# EAGLE design RPi2LSD (EAGLE 6.5.0)
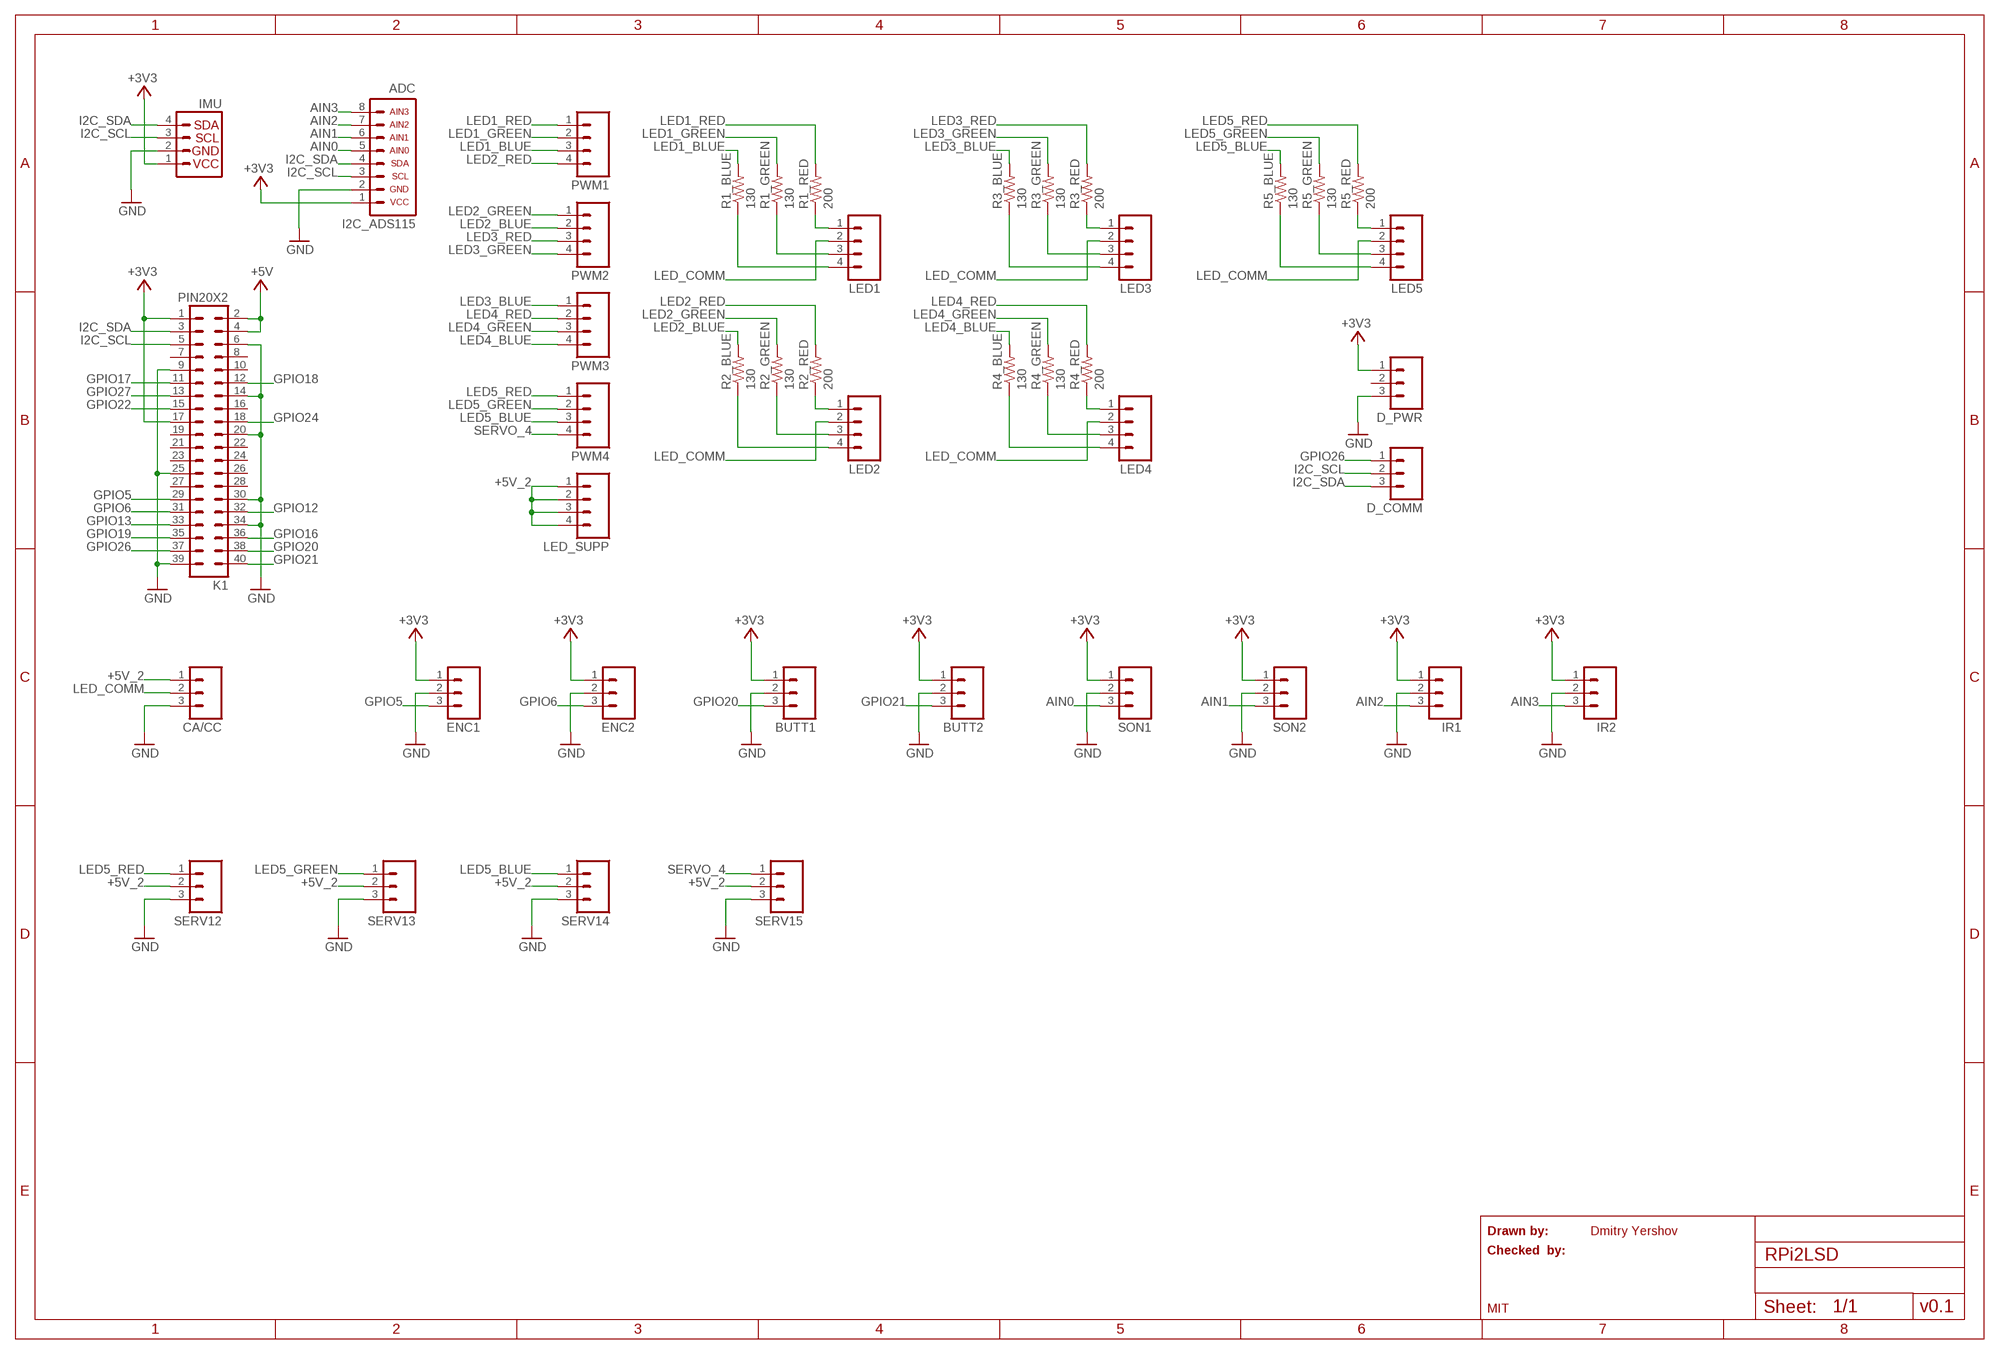
[diagram p0: schematic, sheet 1]

## Parts
ADC  I2C_ADS115  [I2C_AX4]
BUTT1  M03PTH  [1X03]
BUTT2  M03PTH  [1X03]
CA/CC  M03PTH  [1X03]
D_COMM  M03PTH  [1X03]
D_PWR  M03PTH  [1X03]
ENC1  M03PTH  [1X03]
ENC2  M03PTH  [1X03]
IMU  I2C_IMU_L3GD20H+LSM303  [1X04]
IR1  M03PTH  [1X03]
IR2  M03PTH  [1X03]
K1  PIN20X2  [PIN_20X2]
LED1  M04PTH  [1X04]
LED2  M04PTH  [1X04]
LED3  M04PTH  [1X04]
LED4  M04PTH  [1X04]
LED5  M04PTH  [1X04]
LED_SUPP  M041X04_NO_SILK  [1X04_NO_SILK]
PWM1  M041X04_NO_SILK  [1X04_NO_SILK]
PWM2  M041X04_NO_SILK  [1X04_NO_SILK]
PWM3  M041X04_NO_SILK  [1X04_NO_SILK]
PWM4  M041X04_NO_SILK  [1X04_NO_SILK]
R1_BLUE  130  R-US_0207/9  [0207/9]
R1_GREEN  130  R-US_0207/9  [0207/9]
R1_RED  200  R-US_0207/9  [0207/9]
R2_BLUE  130  R-US_0207/9  [0207/9]
R2_GREEN  130  R-US_0207/9  [0207/9]
R2_RED  200  R-US_0207/9  [0207/9]
R3_BLUE  130  R-US_0207/9  [0207/9]
R3_GREEN  130  R-US_0207/9  [0207/9]
R3_RED  200  R-US_0207/9  [0207/9]
R4_BLUE  130  R-US_0207/9  [0207/9]
R4_GREEN  130  R-US_0207/9  [0207/9]
R4_RED  200  R-US_0207/9  [0207/9]
R5_BLUE  130  R-US_0207/9  [0207/9]
R5_GREEN  130  R-US_0207/9  [0207/9]
R5_RED  200  R-US_0207/9  [0207/9]
SERV12  M03PTH  [1X03]
SERV13  M03PTH  [1X03]
SERV14  M03PTH  [1X03]
SERV15  M03PTH  [1X03]
SON1  M03PTH  [1X03]
SON2  M03PTH  [1X03]

## Nets
+3V3: ADC.1 BUTT1.1 BUTT2.1 D_PWR.1 ENC1.1 ENC2.1 IMU.1 IR1.1 IR2.1 K1.1 K1.17 SON1.1 SON2.1
+5V: K1.2 K1.4
+5V_2: CA/CC.1 LED_SUPP.1 LED_SUPP.2 LED_SUPP.3 LED_SUPP.4 SERV12.2 SERV13.2 SERV14.2 SERV15.2
AIN0: ADC.5 SON1.3
AIN1: ADC.6 SON2.3
AIN2: ADC.7 IR1.3
AIN3: ADC.8 IR2.3
GND: ADC.2 BUTT1.2 BUTT2.2 CA/CC.3 D_PWR.3 ENC1.2 ENC2.2 IMU.2 IR1.2 IR2.2 K1.6 K1.9 K1.14 K1.20 K1.25 K1.30 K1.34 K1.39 SERV12.3 SERV13.3 SERV14.3 SERV15.3 SON1.2 SON2.2
GPIO5: ENC1.3 K1.29
GPIO6: ENC2.3 K1.31
GPIO12: K1.32
GPIO13: K1.33
GPIO16: K1.36
GPIO17: K1.11
GPIO18: K1.12
GPIO19: K1.35
GPIO20: BUTT1.3 K1.38
GPIO21: BUTT2.3 K1.40
GPIO22: K1.15
GPIO24: K1.18
GPIO26: D_COMM.1 K1.37
GPIO27: K1.13
I2C_SCL: ADC.3 D_COMM.2 IMU.3 K1.5
I2C_SDA: ADC.4 D_COMM.3 IMU.4 K1.3
LED1_BLUE: PWM1.3 R1_BLUE.2
LED1_GREEN: PWM1.2 R1_GREEN.2
LED1_RED: PWM1.1 R1_RED.2
LED2_BLUE: PWM2.2 R2_BLUE.2
LED2_GREEN: PWM2.1 R2_GREEN.2
LED2_RED: PWM1.4 R2_RED.2
LED3_BLUE: PWM3.1 R3_BLUE.2
LED3_GREEN: PWM2.4 R3_GREEN.2
LED3_RED: PWM2.3 R3_RED.2
LED4_BLUE: PWM3.4 R4_BLUE.2
LED4_GREEN: PWM3.3 R4_GREEN.2
LED4_RED: PWM3.2 R4_RED.2
LED5_BLUE: PWM4.3 R5_BLUE.2 SERV14.1
LED5_GREEN: PWM4.2 R5_GREEN.2 SERV13.1
LED5_RED: PWM4.1 R5_RED.2 SERV12.1
LED_COMM: CA/CC.2 LED1.2 LED2.2 LED3.2 LED4.2 LED5.2
N$1: LED1.4 R1_BLUE.1
N$2: LED1.3 R1_GREEN.1
N$3: LED1.1 R1_RED.1
N$4: LED2.4 R2_BLUE.1
N$5: LED2.3 R2_GREEN.1
N$6: LED2.1 R2_RED.1
N$7: LED3.4 R3_BLUE.1
N$8: LED3.3 R3_GREEN.1
N$9: LED3.1 R3_RED.1
N$10: LED4.4 R4_BLUE.1
N$11: LED4.3 R4_GREEN.1
N$12: LED4.1 R4_RED.1
N$13: LED5.4 R5_BLUE.1
N$14: LED5.3 R5_GREEN.1
N$15: LED5.1 R5_RED.1
SERVO_4: PWM4.4 SERV15.1
Unconnected: D_PWR.2 K1.7 K1.8 K1.10 K1.16 K1.19 K1.21 K1.22 K1.23 K1.24 K1.26 K1.27 K1.28

## Notes on the sheet
- Drawn by: | Dmitry Yershov
- Checked  by:
- MIT | v0.1

## Library data of the parts
ADC = cambridge_garage_electronics:I2C_ADS1*15
BUTT1 BUTT2 CA/CC D_COMM D_PWR ENC1 ENC2 IR1 IR2 SERV12-SERV15 SON1 SON2 = cambridge_garage_electronics:M03: Header 3 Standard 3-pin 0.1" header. Use with straight break away headers (SKU : PRT-00116), right angle break away headers (PRT-00553), swiss pins (PRT-00743), machine pins (PRT-00117), and female headers (PRT-00115). Molex polarized connector foot print use with SKU : PRT-08232 with associated crimp pins and housings.
IMU = cambridge_garage_electronics:I2C_IMU_L3GD20H+LSM303: SparkFun has standardized on a pinout for all I2C based sensor breakouts. This pinout allows I2C boards to be plugged directly into the headers on Arduino Uno compatible boards, and to be daisy chained easily.
K1 = FLYFISH:PIN20X2
LED1-LED5 LED_SUPP PWM1-PWM4 = SparkFun-Connectors:M04: Header 4 Standard 4-pin 0.1" header. Use with straight break away headers (SKU : PRT-00116), right angle break away headers (PRT-00553), swiss pins (PRT-00743), machine pins (PRT-00117), and female headers (PRT-00115). Molex polarized connector foot print use with SKU : PRT-08231 with associated crimp pins and housings. 1MM SMD Version SKU: PRT-10208
R1_BLUE R1_GREEN R1_RED R2_BLUE R2_GREEN R2_RED R3_BLUE R3_GREEN R3_RED R4_BLUE R4_GREEN R4_RED R5_BLUE R5_GREEN R5_RED = adafruit:R-US_: RESISTOR, American symbol

## Board
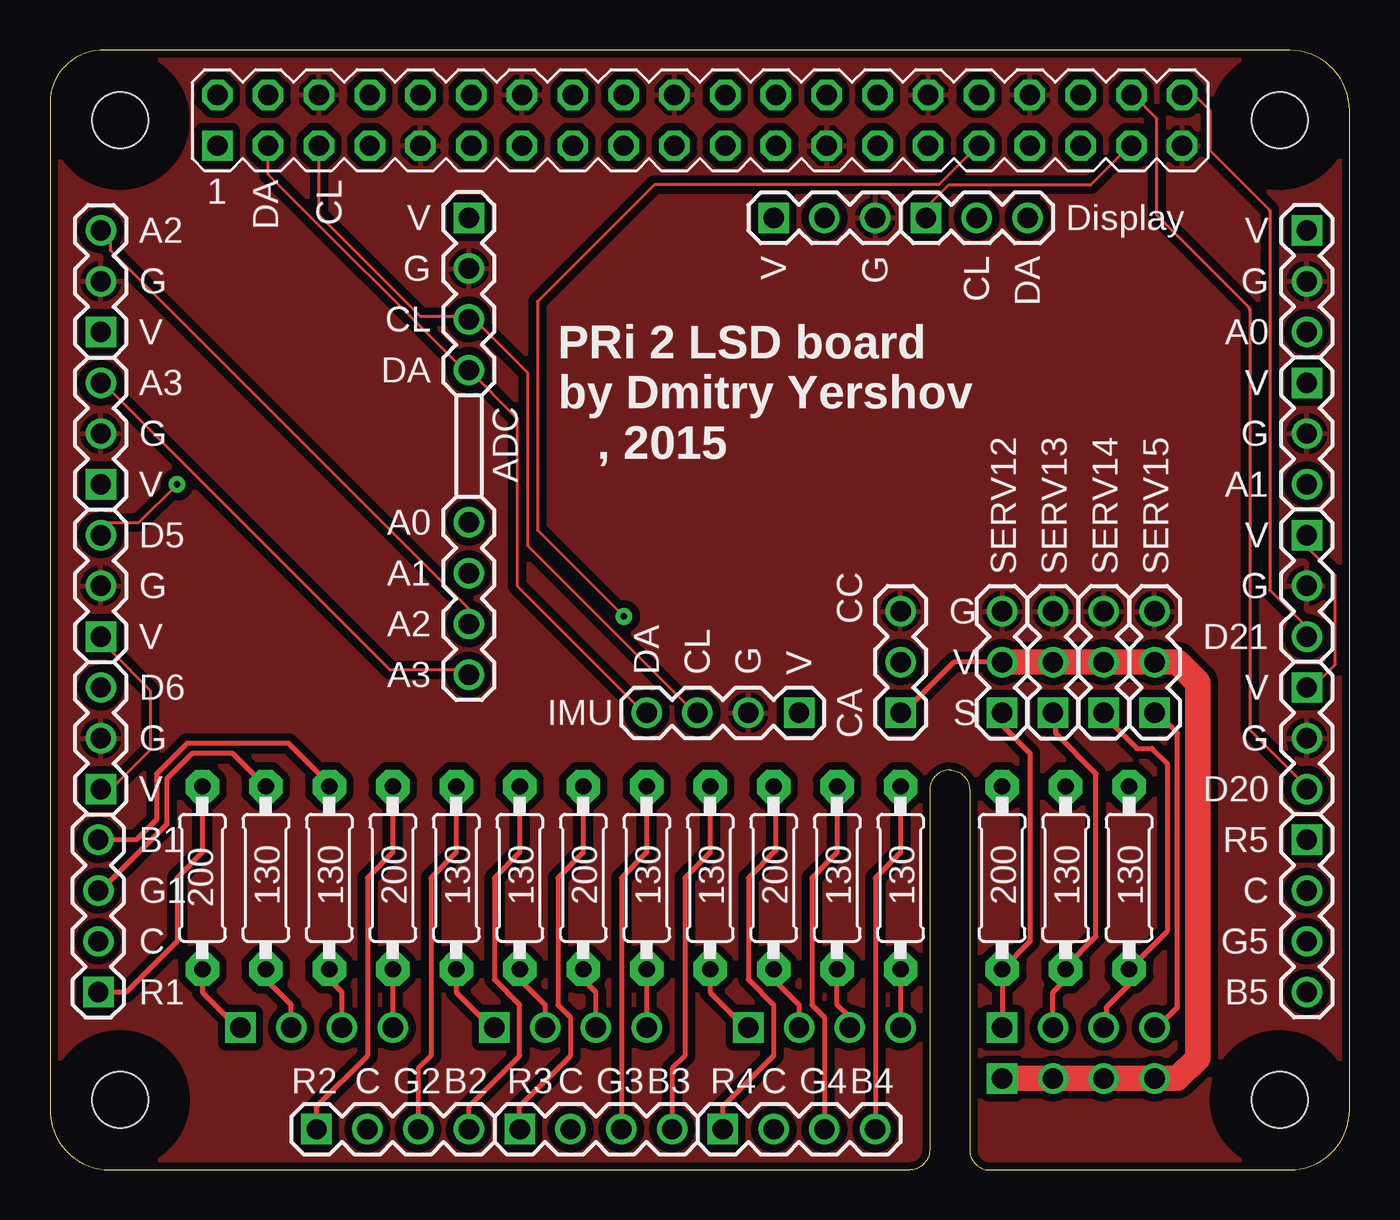
[diagram p1: board, top side]
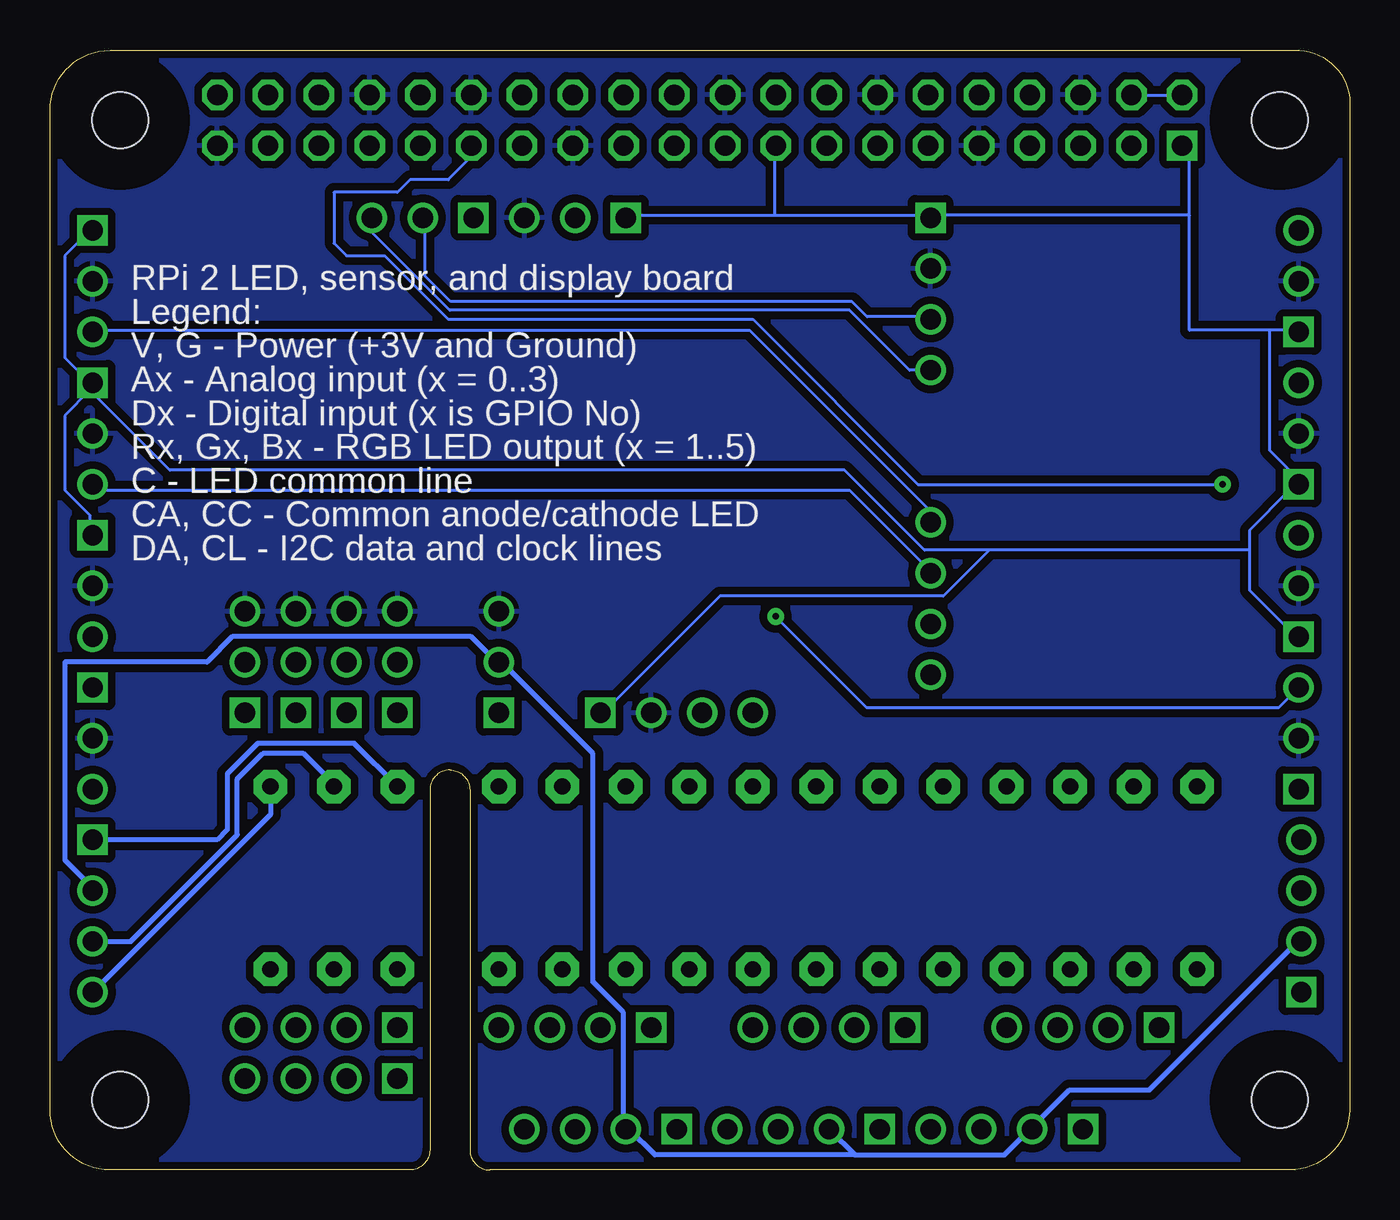
[diagram p2: board, bottom side, seen from below]

Size 65 x 56.02 mm. Coordinates in mm from the lower left corner, seen from the top.
Outline: 0,3 arc90 3,0 43,0 arc90 44,1 44,19 arc-90 45,20 arc-90 46,19 46,1 arc90 47,0 62,0 arc90 65,3 65,53 arc90 62,56 3,56 arc90 0,53.63 0,3
Copper layers (1*16): Top 0.035mm / dielectric 1.6mm / Bottom 0.035mm
Design rules "ITEADstudio_DRC *": minimum track width 6mil, minimum drill 13mil, track to track 6mil, track to pad 6mil, pad to pad 6mil, via to via 6mil, smd to smd 0mil, copper to edge 15mil, drill to drill 15mil, minimum pad ring 10mil, minimum via ring 10mil, stop-mask expansion 3mil, vias tented up to drill 12mil, thermal gap 10mil
Holes 2.8 mm at 3.5,3.5 3.5,52.5 61.5,52.5 61.5,3.5
tRestrict: area 1.9,51 to 5,54; area 60,51 to 63,54; area 60,1.9 to 63,5; area 1.9,1.9 to 5,5
bRestrict: area 1.9,1.9 to 5,5; area 1.9,51 to 5,54; area 60,1.9 to 63,5; area 60,51 to 63,54

### Footprints (pad centres in the part's own frame; a part is rotated, then mirrored left to right if it is on the bottom)
I2C_AX4 = drill 1.016 pad 1.524 square: 1 0,0 | drill 1.016 pad 1.524: 2 2.54,0; 3 5.08,0; 4 7.62,0; 5 15.24,0; 6 17.78,0; 7 20.32,0; 8 22.86,0
1X03 = drill 1.016 pad 1.524 square: 1 0,0 | drill 1.016 pad 1.524: 2 2.54,0; 3 5.08,0
1X04 = drill 1.016 pad 1.524 square: 1 0,0 | drill 1.016 pad 1.524: 2 2.54,0; 3 5.08,0; 4 7.62,0
PIN_20X2 = drill 1.016 square: 1 -24.13,-1.27 | drill 1.016 octagon: 2 -24.13,1.27; 3 -21.59,-1.27; 4 -21.59,1.27; 5 -19.05,-1.27; 6 -19.05,1.27; 7 -16.51,-1.27; 8 -16.51,1.27; 9 -13.97,-1.27; 10 -13.97,1.27; 11 -11.43,-1.27; 12 -11.43,1.27; 13 -8.89,-1.27; 14 -8.89,1.27; 15 -6.35,-1.27; 16 -6.35,1.27; 17 -3.81,-1.27; 18 -3.81,1.27; 19 -1.27,-1.27; 20 -1.27,1.27; 21 1.27,-1.27; 22 1.27,1.27; 23 3.81,-1.27; 24 3.81,1.27; 25 6.35,-1.27; 26 6.35,1.27; 27 8.89,-1.27; 28 8.89,1.27; 29 11.43,-1.27; 30 11.43,1.27; 31 13.97,-1.27; 32 13.97,1.27; 33 16.51,-1.27; 34 16.51,1.27; 35 19.05,-1.27; 36 19.05,1.27; 37 21.59,-1.27; 38 21.59,1.27; 39 24.13,-1.27; 40 24.13,1.27
1X04_NO_SILK = drill 1.016 pad 1.524 square: 1 0,0 | drill 1.016 pad 1.524: 2 2.54,0; 3 5.08,0; 4 7.62,0
0207/9 = drill 0.813 pad 1.676 octagon: 1 -4.572,0; 2 4.572,0

### Placement (x,y rotation side)
ADC  20.95,47.62 270 top
BUTT1  62.87,24.13 270 top
BUTT2  62.87,31.75 270 top
CA/CC  42.55,22.86 90 top
D_COMM  43.81,47.62 0 top
D_PWR  36.2,47.62 0 top
ENC1  2.54,26.67 90 top
ENC2  2.54,19.05 90 top
IMU  37.47,22.86 180 top
IR1  2.54,41.91 90 top
IR2  2.54,34.29 90 top
K1  32.5,52.5 0 top
LED1  2.41,8.89 90 top
LED2  13.34,2.03 0 top
LED3  23.5,2.03 0 top
LED4  33.66,2.03 0 top
LED5  62.87,16.51 270 top
LED_SUPP  47.62,4.57 0 top
PWM1  9.53,7.11 0 top
PWM2  22.23,7.11 0 top
PWM3  34.92,7.11 0 top
PWM4  47.62,7.11 0 top
R1_BLUE  13.97,14.61 270 top
R1_GREEN  10.79,14.61 270 top
R1_RED  7.62,14.61 270 top
R2_BLUE  23.5,14.61 270 top
R2_GREEN  20.32,14.61 270 top
R2_RED  17.14,14.61 270 top
R3_BLUE  33.02,14.61 270 top
R3_GREEN  29.84,14.61 270 top
R3_RED  26.67,14.61 270 top
R4_BLUE  42.55,14.61 270 top
R4_GREEN  39.37,14.61 270 top
R4_RED  36.2,14.61 270 top
R5_BLUE  53.98,14.61 270 top
R5_GREEN  50.8,14.61 270 top
R5_RED  47.62,14.61 270 top
SERV12  47.62,22.86 90 top
SERV13  50.16,22.86 90 top
SERV14  52.7,22.86 90 top
SERV15  55.24,22.86 90 top
SON1  62.87,46.99 270 top
SON2  62.87,39.37 270 top

### Tracks (layer width: path | path; a pad name or v marks a point on that pad's centre or on a via)
+3V3
  Top 0.152: ENC2.1 3,19 5,21 5,23.97 3,26 ENC1.1 | BUTT1.1 63,24 64.25,25.25 64.25,29.75 63,31 BUTT2.1
  Bottom 0.152: 28.75,47.75 36,47.75 D_PWR.1 | 28.75,47.75 21,47.75 | 28.75,47.75 28.75,51 K1.17 | 63,39 64.25,37.73 64.25,34 63,32.75 63,32 BUTT2.1 | 4,42 4,36 3,35 IR2.1 3,34 5,31.97 5,31 | 4,42 3,42 IR1.1 | 8,47.75 8,42 4,42 | 8,47.75 8,51 K1.1 | 5,31 5,29 3,27 ENC1.1 | 63,39 59,35 25.25,35 21.25,31 18.03,31 | 5,31 18.03,31 | 63,39 SON2.1 62.99,39.37 64.26,40.64 64.26,45.72 62.99,46.99 SON1.1 | 8,47.75 21,47.75 | 21,47.75 ADC.1 | IMU.1 37.34,22.86 31.5,28.7 20.32,28.7 18.03,30.99 18.03,31
+5V
  Bottom 0.152: K1.2 8.75,53.75 10.75,53.75 K1.4
+5V_2
  Top 0.254: CA/CC.1 42.67,22.86 45.21,25.4 SERV12.2
  Top 1.27: LED_SUPP.1 LED_SUPP.2 LED_SUPP.3 LED_SUPP.4 56.39,4.57 57.4,5.59 57.4,24.38 56.39,25.4 SERV15.2 | 55.37,25.4 SERV15.2 | SERV15.2 SERV14.2 SERV13.2 SERV12.2
AIN0
  Bottom 0.152: ADC.5 21,33 30,42 63,42 SON1.3
AIN1
  Bottom 0.152: ADC.6 21,30 25,34 63,34 SON2.3
AIN2
  Top 0.152: ADC.7 21,28 3,46 3,47 IR1.3
AIN3
  Top 0.152: IR2.3 3,39 17,25 21,25 ADC.8
GND
  Bottom 0.152: SON2.2 62.74,36.83 62.74,36.96
  pour Top (isolate 0.381): 0,3 arc90 3,0 43,0 arc90 44,1 44,19 arc-90 45,20 arc-90 46,19 46,1 arc90 47,0 62,0 arc90 65,3 65,53 arc90 62,56 3,56 arc90 0,53 0,37.5 0,18.5
  pour Bottom (isolate 0.381): 0,3 arc90 3,0 43,0 arc90 44,1 44,19 arc-90 45,20 arc-90 46,19 46,1 arc90 47,0 62,0 arc90 65,3 65,53 arc90 62,56 3,56 arc90 0,53 0,37.5 0,18.5
GPIO5  (via drill 0.33)
  Top 0.152: v6.35,34.29 4.45,32.38 2.54,32.38 ENC1.3
  Bottom 0.152: v6.35,34.29 21.59,34.29 29.84,42.55 45.09,42.55 48.26,45.72 50.16,45.72 50.8,46.35 50.8,48.9 47.62,48.9 46.99,49.53 45.09,49.53 43.81,50.8 K1.29
GPIO6  (via drill 0.33)
  Top 0.152: v28.7,27.69 24.38,32 24.38,43.43 30.23,49.28 44.45,49.28 46.23,51.05 K1.31
  Bottom 0.152: ENC2.3 3.56,23.11 24.13,23.11 v28.7,27.69
GPIO20
  Top 0.152: BUTT1.3 63,19 60,22 60,43 59.94,43.18 55.37,47.75 55.37,52.58 54.1,53.85 K1.38
GPIO21
  Top 0.152: BUTT2.3 63,27 61,29 61,48 58,51 58,53 57,54 K1.40
GPIO26
  Top 0.152: D_COMM.1 43.94,47.75 43.94,48.26 44.96,49.28 52.07,49.28 53.85,51.05 K1.37
I2C_SCL
  Top 0.152: K1.5 13.46,51.05 13.46,47.75 18.54,42.67 20.57,42.67 ADC.3 21.08,42.67 23.88,39.88 23.88,31.24 32.26,22.86 IMU.3
  Bottom 0.152: D_COMM.2 46.23,47.5 46.23,44.7 44.96,43.43 24.89,43.43 24.13,42.67 21.08,42.67 ADC.3
I2C_SDA
  Top 0.152: K1.3 10.92,51.05 10.92,49.78 20.83,39.88 ADC.4 23.37,37.59 23.37,29.21 29.72,22.86 IMU.4
  Bottom 0.152: D_COMM.3 49,47 45,43 25,43 22,40 21,40 ADC.4
LED1_BLUE
  Top 0.254: PWM1.3 14.61,8.89 13.97,9.53 R1_BLUE.2
LED1_GREEN
  Top 0.254: PWM1.2 12.06,8.26 10.79,9.53 R1_GREEN.2
LED1_RED
  Top 0.254: R1_RED.2 7.62,8.89 9.4,7.11 PWM1.1
LED2_BLUE
  Top 0.254: PWM2.2 24.77,8.26 23.5,9.53 R2_BLUE.2
LED2_GREEN
  Top 0.254: R2_GREEN.2 20.32,8.89 22.1,7.11 PWM2.1
LED2_RED
  Top 0.254: R2_RED.2 PWM1.4
LED3_BLUE
  Top 0.254: R3_BLUE.2 33.02,8.89 34.8,7.11 PWM3.1
LED3_GREEN
  Top 0.254: R3_GREEN.2 PWM2.4
LED3_RED
  Top 0.254: PWM2.3 27.3,8.89 26.67,9.53 R3_RED.2
LED4_BLUE
  Top 0.254: R4_BLUE.2 PWM3.4
LED4_GREEN
  Top 0.254: R4_GREEN.2 39.37,8.26 40.01,7.62 PWM3.3
LED4_RED
  Top 0.254: PWM3.2 37.47,8.26 36.2,9.53 R4_RED.2
LED5_BLUE
  Top 0.254: PWM4.3 52.83,7.11 52.83,8.13 54.1,9.4 54.1,9.91 R5_BLUE.2 55.88,11.94 55.88,20.32 55.12,21.08 54.36,21.08 52.58,22.86 SERV14.1
LED5_GREEN
  Top 0.254: PWM4.2 50.16,8.89 50.8,9.53 R5_GREEN.2 50.8,10.16 52.32,11.68 52.32,19.81 50.29,21.84 50.29,22.86 SERV13.1
LED5_RED
  Top 0.254: PWM4.1 R5_RED.2 49.02,11.43 49.02,20.83 47.75,22.1 47.75,22.86 SERV12.1
LED_COMM
  Bottom 0.152: 36.32,2.03 LED4.2
  Bottom 0.254: 16,2 17.25,0.75 24.75,0.75 | 24.75,0.75 26,2 LED3.2 | 24.75,0.75 34.75,0.75 36,2 LED4.2 | 16,2 14,4 10,4 3,11 LED1.2 | 16,2 LED2.2 | LED5.2 62.99,14.22 64.26,15.49 64.26,25.4 57.15,25.4 55.88,26.67 43.94,26.67 42.67,25.4 CA/CC.2 42.42,25.4 37.85,20.83 37.85,9.4 36.32,7.87 36.32,2.03
N$1
  Top 0.254: LED1.4 4.32,16.51 5.33,17.53 5.33,19.81 6.86,21.34 11.94,21.34 13.97,19.3 R1_BLUE.1
N$2
  Top 0.254: R1_GREEN.1 9.14,20.83 7.11,20.83 5.84,19.56 5.84,17.27 2.54,13.97 LED1.3
N$3
  Top 0.254: R1_RED.1 7.62,15.88 6.35,14.61 6.35,11.43 3.81,8.89 LED1.1
N$4
  Top 0.254: R2_BLUE.1 23.5,15.88 22.23,14.61 22.23,9.53 23.5,8.26 23.5,5.71 20.95,3.17 LED2.4
N$5
  Top 0.254: LED2.3 18.41,5.08 19.05,5.71 19.05,14.61 20.32,15.88 R2_GREEN.1
N$6
  Top 0.254: LED2.1 13.34,3.17 15.88,5.71 15.88,14.61 17.14,15.88 R2_RED.1
N$7
  Top 0.254: LED3.4 31.11,5.08 31.75,5.71 31.75,14.61 33.02,15.88 R3_BLUE.1
N$8
  Top 0.254: LED3.3 28.57,14.61 29.84,15.88 R3_GREEN.1
N$9
  Top 0.254: R3_RED.1 26.67,15.88 25.4,14.61 25.4,8.26 26.04,7.62 26.04,5.71 23.5,3.17 LED3.1
N$10
  Top 0.254: LED4.4 41.27,14.61 42.55,15.88 R4_BLUE.1
N$11
  Top 0.254: LED4.3 38.73,7.62 38.1,8.26 38.1,14.61 39.37,15.88 R4_GREEN.1
N$12
  Top 0.254: LED4.1 33.66,3.17 36.2,5.71 36.2,8.26 34.92,9.53 34.92,14.61 36.32,16 36.32,19.05 R4_RED.1
N$13
  Bottom 0.254: R5_BLUE.1 53.98,17.78 LED5.4
N$14
  Bottom 0.254: LED5.3 60.96,11.43 55.63,16.76 55.63,19.56 54.36,20.83 52.32,20.83 50.8,19.3 R5_GREEN.1
N$15
  Bottom 0.254: LED5.1 56.64,16.51 56.13,17.02 56.13,19.81 54.61,21.34 49.78,21.34 R5_RED.1
SERVO_4
  Top 0.254: SERV15.1 55.37,22.86 56.39,21.84 56.39,8.13 55.37,7.11 PWM4.4

### Text on the board
tNames: DA | CL | V | V | Display | A2 | G | V | G | CL | DA | G | G | CL | A0 | V | DA | V | A3 | G | G | PRi 2 LSD board / by Dmitry Yershov / , 2015 | A1 | V | A0 | V | D5 | A1 | G | G | G | A2 | CC | D21 | V | V | A3 | DA | CL | G | V | V | D6 | S | CA | G | G | D20 | V | R5 | B1 | C | G1 | G5 | C | B5 | R1 | R2 | C | G2 | B2 | R3 | C | G3 | B3 | R4 | C | G4 | B4
bNames: RPi 2 LED, sensor, and display board / Legend: / V, G - Power (+3V and Ground) / Ax - Analog input (x = 0..3) / Dx - Digital input (x is GPIO No) / Rx, Gx, Bx - RGB LED output (x = 1..5) / C - LED common line / CA, CC - Common anode/cathode LED / DA, CL - I2C data and clock lines
tStop: MIT